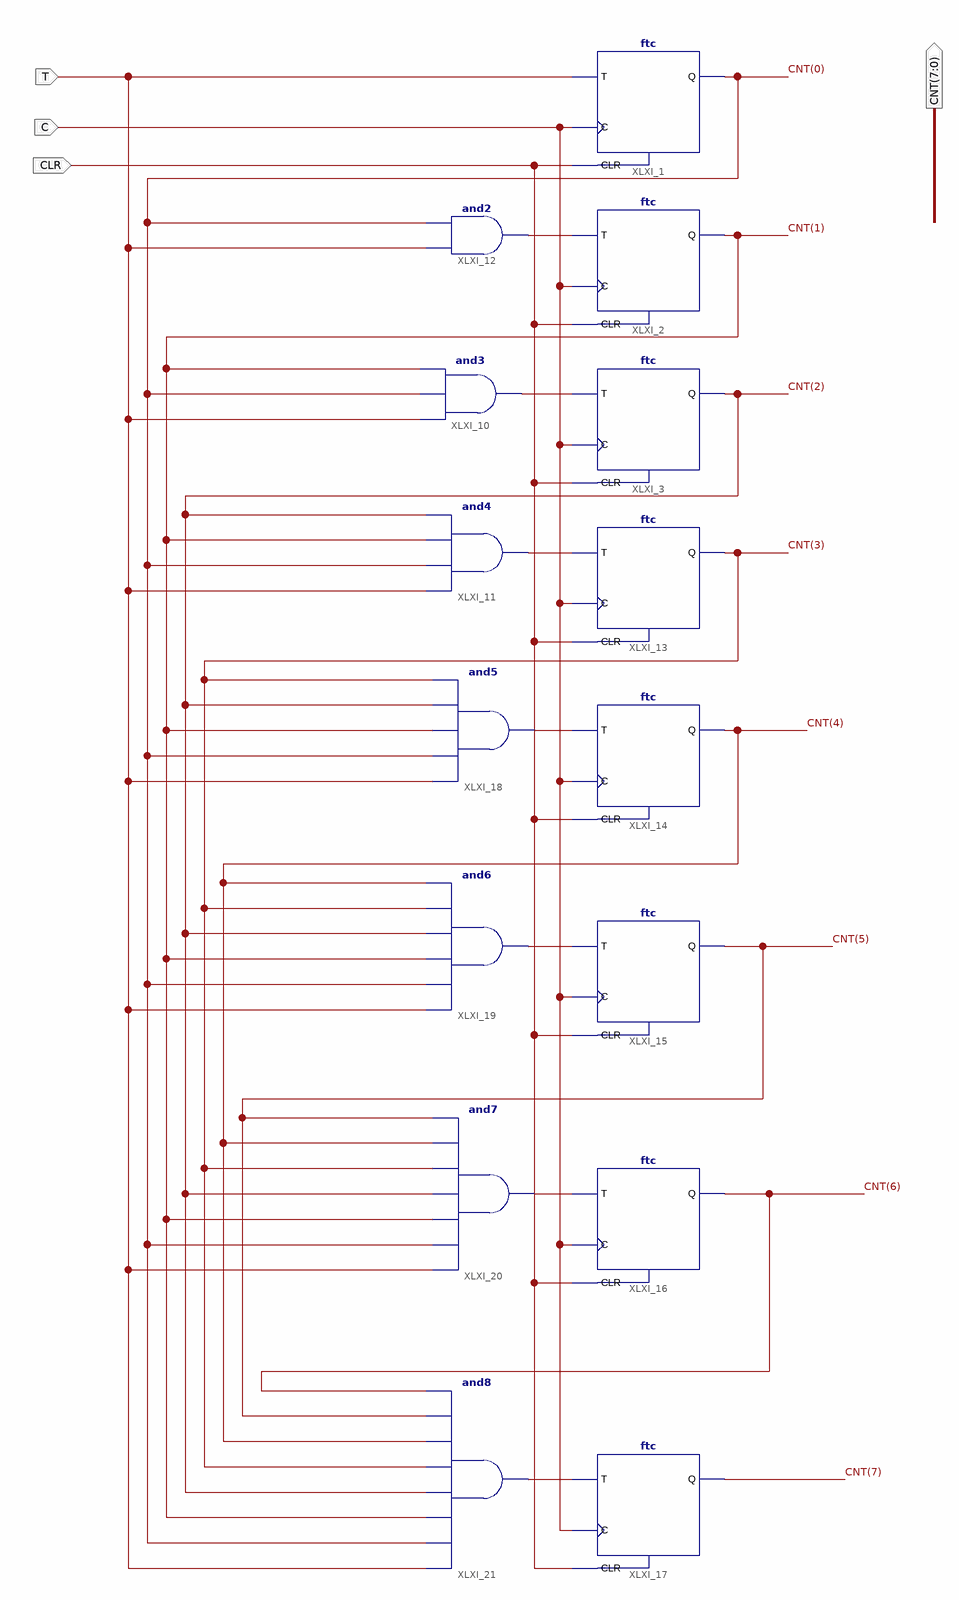
[diagram p0: schematic sheet 1]
// Xilinx ISE schematic lab7_4_CNT.sch (spartan3) as structural Verilog: 15 symbols, 4 ports
module lab7_4_CNT (
  input  C,
  input  T,
  input  CLR,
  output [7:0] CNT
);

  wire XLXN_4, XLXN_5, XLXN_7, XLXN_12, XLXN_13, XLXN_14, XLXN_15;

  ftc XLXI_1 (.C(C), .CLR(CLR), .T(T), .Q(CNT[0]));
  ftc XLXI_2 (.C(C), .CLR(CLR), .T(XLXN_7), .Q(CNT[1]));
  ftc XLXI_3 (.C(C), .CLR(CLR), .T(XLXN_4), .Q(CNT[2]));
  and XLXI_10 (XLXN_4, T, CNT[0], CNT[1]);
  and XLXI_11 (XLXN_5, T, CNT[0], CNT[1], CNT[2]);
  and XLXI_12 (XLXN_7, T, CNT[0]);
  ftc XLXI_13 (.C(C), .CLR(CLR), .T(XLXN_5), .Q(CNT[3]));
  ftc XLXI_14 (.C(C), .CLR(CLR), .T(XLXN_12), .Q(CNT[4]));
  ftc XLXI_15 (.C(C), .CLR(CLR), .T(XLXN_13), .Q(CNT[5]));
  ftc XLXI_16 (.C(C), .CLR(CLR), .T(XLXN_14), .Q(CNT[6]));
  ftc XLXI_17 (.C(C), .CLR(CLR), .T(XLXN_15), .Q(CNT[7]));
  and XLXI_18 (XLXN_12, T, CNT[0], CNT[1], CNT[2], CNT[3]);
  and XLXI_19 (XLXN_13, T, CNT[0], CNT[1], CNT[2], CNT[3], CNT[4]);
  and XLXI_20 (CLR, T, CNT[0], CNT[1], CNT[2], CNT[3], CNT[4], CNT[5]);
  and XLXI_21 (XLXN_15, T, CNT[0], CNT[1], CNT[2], CNT[3], CNT[4], CNT[5], CNT[6]);
endmodule
